# EAGLE design VectrexCard4 (EAGLE 9.6.2)
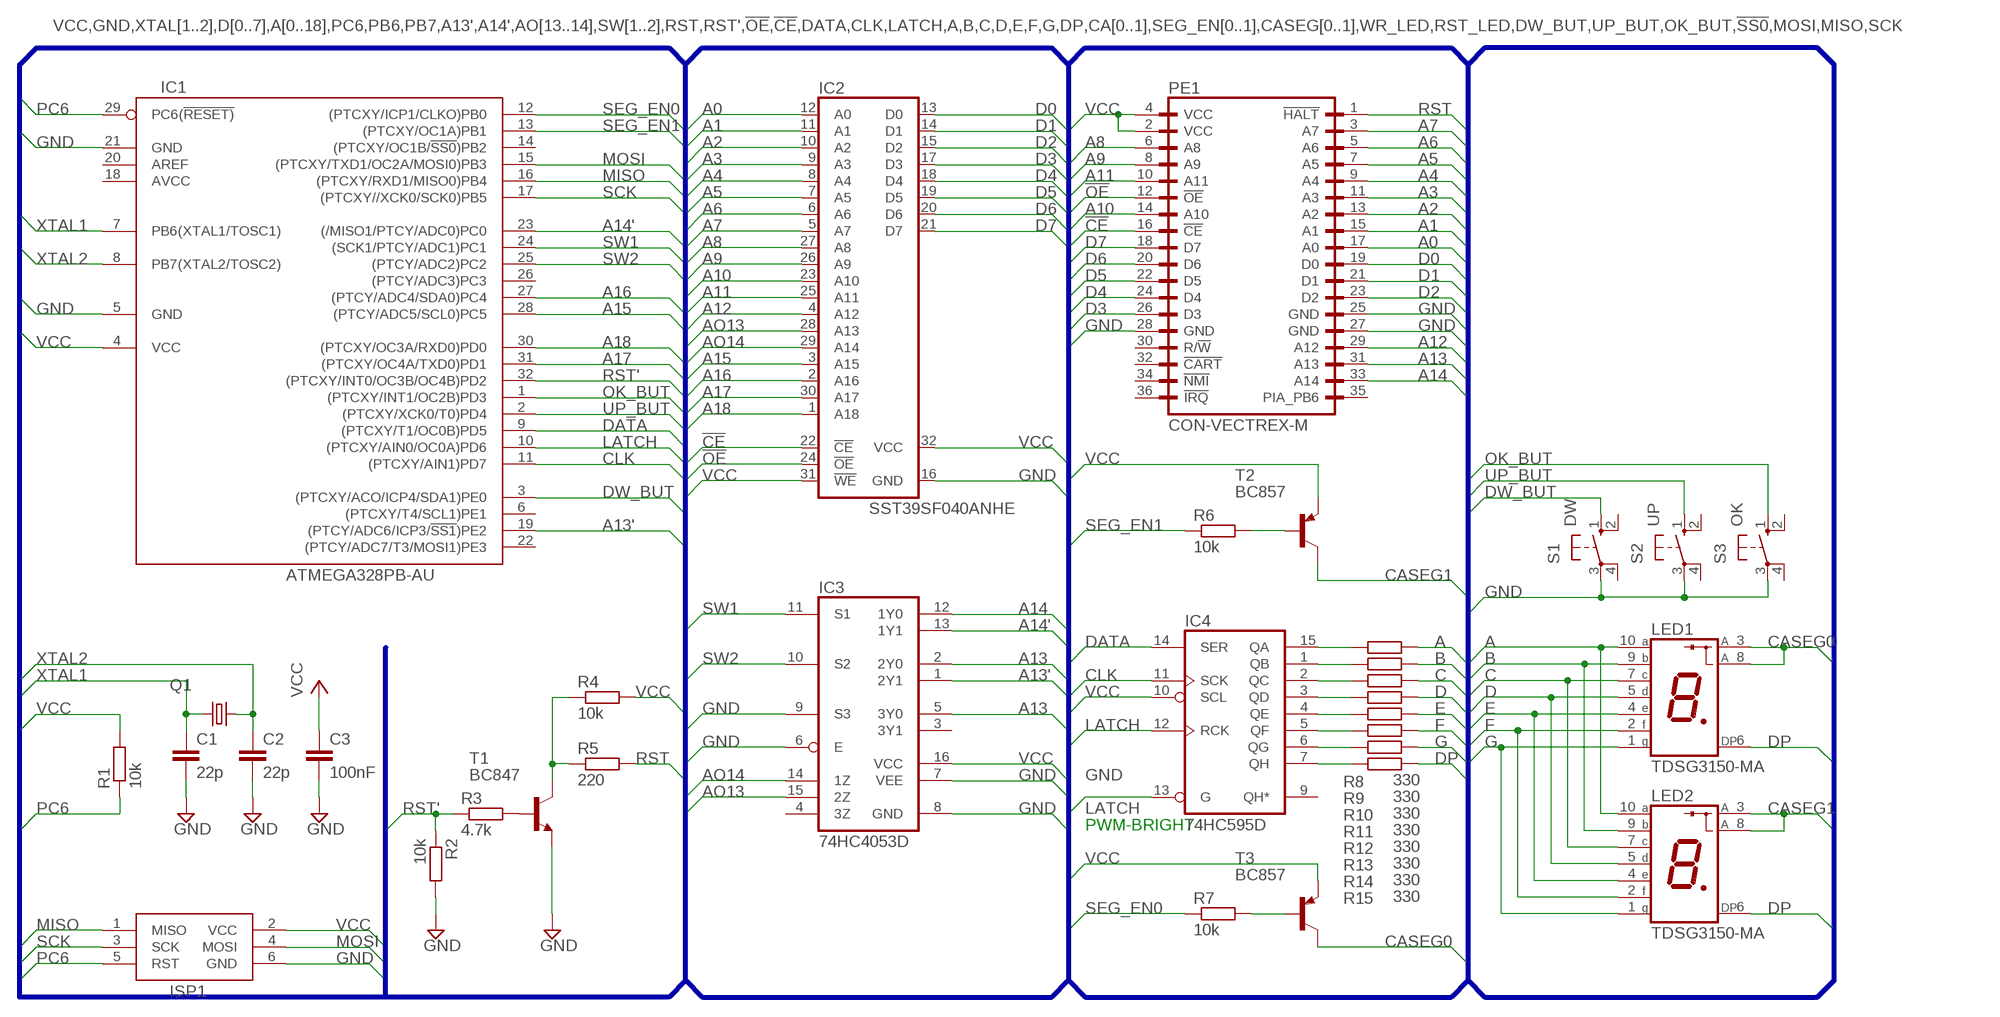
[diagram p0: schematic, sheet 1]

## Parts
C1  22p  C-EUC2012  [C2012]
C2  22p  C-EUC2012  [C2012]
C3  100nF  C-EU050-025X075  [C050-025X075]
IC1  ATMEGA328PB-AU  [TQFP32-08]
IC2  SST39SF040ANHE  [S32]
IC3  74HC4053D  744053D  [SO16]
IC4  74HC595D  [SO16]
ISP1  AVRISP-6  [AVRISP]
LED1  TDSG3150-MA  [LA-401]
LED2  TDSG3150-MA  [LA-401]
PE1  CON-VECTREX-M  [PCB_VECTREX_CONNECTOR]
Q1  8MHz  CRYSTALHC49U-V  [HC49U-V]
R1  10k  R-EU_0204/7  [0204/7]
R2  10k  R-EU_M2012  [M2012]
R3  4.7k  R-EU_M2012  [M2012]
R4  10k  R-EU_R2012  [R2012]
R5  220  R-EU_R2012  [R2012]
R6  10k  R-EU_M2012  [M2012]
R7  10k  R-EU_M2012  [M2012]
R8  330  R-EU_M2012  [M2012]
R9  330  R-EU_M2012  [M2012]
R10  330  R-EU_M2012  [M2012]
R11  330  R-EU_M2012  [M2012]
R12  330  R-EU_M2012  [M2012]
R13  330  R-EU_M2012  [M2012]
R14  330  R-EU_M2012  [M2012]
R15  330  R-EU_M2012  [M2012]
S1  DW  10-XX  [B3F-10XX]
S2  UP  10-XX  [B3F-10XX]
S3  OK  10-XX  [B3F-10XX]
T1  BC847  [SOT23]
T2  BC857  BC857A-PNP-SOT23-BEC  [SOT23-BEC]
T3  BC857  BC857A-PNP-SOT23-BEC  [SOT23-BEC]

## Nets
!CE: IC2.22(!CE) PE1.16(!CE)
!OE: IC2.24(!OE) PE1.12(!OE)
A: LED1.10(A) LED2.10(A) R8.2
A0: IC2.12(A0) PE1.17(A0)
A1: IC2.11(A1) PE1.15(A1)
A2: IC2.10(A2) PE1.13(A2)
A3: IC2.9(A3) PE1.11(A3)
A4: IC2.8(A4) PE1.9(A4)
A5: IC2.7(A5) PE1.7(A5)
A6: IC2.6(A6) PE1.5(A6)
A7: IC2.5(A7) PE1.3(A7)
A8: IC2.27(A8) PE1.6(A8)
A9: IC2.26(A9) PE1.8(A9)
A10: IC2.23(A10) PE1.14(A10)
A11: IC2.25(A11) PE1.10(A11)
A12: IC2.4(A12) PE1.29(A12)
A13: IC3.2(2Y0) IC3.5(3Y0) PE1.31(A13)
A13': IC1.19((PTCY/ADC6/ICP3/!SS1!)PE2) IC3.1(2Y1)
A14: IC3.12(1Y0) PE1.33(A14)
A14': IC1.23((/MISO1/PTCY/ADC0)PC0) IC3.13(1Y1)
A15: IC1.28((PTCY/ADC5/SCL0)PC5) IC2.3(A15)
A16: IC1.27((PTCY/ADC4/SDA0)PC4) IC2.2(A16)
A17: IC1.31((PTCXY/OC4A/TXD0)PD1) IC2.30(A17)
A18: IC1.30((PTCXY/OC3A/RXD0)PD0) IC2.1(A18)
AO13: IC2.28(A13) IC3.15(2Z)
AO14: IC2.29(A14) IC3.14(1Z)
B: LED1.9(B) LED2.9(B) R9.2
C: LED1.7(C) LED2.7(C) R10.2
CASEG0: LED1.3(A) LED1.8(A) T3.C
CASEG1: LED2.3(A) LED2.8(A) T2.C
CLK: IC1.11((PTCXY/AIN1)PD7) IC4.11(SCK)
D: LED1.5(D) LED2.5(D) R11.2
D0: IC2.13(D0) PE1.19(D0)
D1: IC2.14(D1) PE1.21(D1)
D2: IC2.15(D2) PE1.23(D2)
D3: IC2.17(D3) PE1.26(D3)
D4: IC2.18(D4) PE1.24(D4)
D5: IC2.19(D5) PE1.22(D5)
D6: IC2.20(D6) PE1.20(D6)
D7: IC2.21(D7) PE1.18(D7)
DATA: IC1.9((PTCXY/T1/OC0B)PD5) IC4.14(SER)
DP: LED1.6(DP) LED2.6(DP) R15.2
DW_BUT: IC1.3((PTCXY/ACO/ICP4/SDA1)PE0) S1.1(S)
E: LED1.4(E) LED2.4(E) R12.2
F: LED1.2(F) LED2.2(F) R13.2
G: LED1.1(G) LED2.1(G) R14.2
GND: C1.2 C2.2 C3.2 IC1.5(GND) IC1.21(GND) IC2.16(GND) IC3.6(E) IC3.7(VEE) IC3.8(GND) IC3.9(S3) IC4.13(G) ISP1.6(GND) PE1.25(GND) PE1.27(GND) PE1.28(GND) R2.2 S1.3(P) S2.3(P) S3.3(P) T1.2(E)
LATCH: IC1.10((PTCXY/AIN0/OC0A)PD6) IC4.12(RCK)
MISO: IC1.16((PTCXY/RXD1/MISO0)PB4) ISP1.1(MISO)
MOSI: IC1.15((PTCXY/TXD1/OC2A/MOSI0)PB3) ISP1.4(MOSI)
N$1: IC4.7(QH) R15.1
N$2: IC4.15(QA) R8.1
N$3: IC4.1(QB) R9.1
N$4: IC4.2(QC) R10.1
N$5: IC4.3(QD) R11.1
N$6: IC4.4(QE) R12.1
N$7: IC4.5(QF) R13.1
N$8: IC4.6(QG) R14.1
N$9: R3.2 T1.1(B)
N$11: R6.2 T2.B
N$12: R7.2 T3.B
N$15: R4.1 R5.1 T1.3(C)
OK_BUT: IC1.1((PTCXY/INT1/OC2B)PD3) S3.1(S)
PC6: IC1.29(PC6(!RESET)) ISP1.5(RST) R1.1
RST: PE1.1(!HALT) R5.2
RST': IC1.32((PTCXY/INT0/OC3B/OC4B)PD2) R2.1 R3.1
SCK: IC1.17((PTCXY//XCK0/SCK0)PB5) ISP1.3(SCK)
SEG_EN0: IC1.12((PTCXY/ICP1/CLKO)PB0) R7.1
SEG_EN1: IC1.13((PTCXY/OC1A)PB1) R6.1
SW1: IC1.24((SCK1/PTCY/ADC1)PC1) IC3.11(S1)
SW2: IC1.25((PTCY/ADC2)PC2) IC3.10(S2)
UP_BUT: IC1.2((PTCXY/XCK0/T0)PD4) S2.1(S)
VCC: C3.1 IC1.4(VCC) IC2.31(!WE) IC2.32(VCC) IC3.16(VCC) IC4.10(SCL) ISP1.2(VCC) PE1.2(VCC) PE1.4(VCC) R1.2 R4.2 T2.E T3.E
XTAL1: C1.1 IC1.7(PB6(XTAL1/TOSC1)) Q1.2
XTAL2: C2.1 IC1.8(PB7(XTAL2/TOSC2)) Q1.1
Unconnected: IC1.6((PTCXY/T4/SCL1)PE1) IC1.14((PTCXY/OC1B/!SS0!)PB2) IC1.18(AVCC) IC1.20(AREF) IC1.22((PTCY/ADC7/T3/MOSI1)PE3) IC1.26((PTCY/ADC3)PC3) IC3.3(3Y1) IC3.4(3Z) IC4.9(QH*) PE1.30(R/!W) PE1.32(!CART) PE1.34(!NMI) PE1.35(PIA_PB6) PE1.36(!IRQ) S1.2(S1) S1.4(P1) S2.2(S1) S2.4(P1) S3.2(S1) S3.4(P1)

## Buses
VCC,GND,XTAL[1..2],D[0..7],A[0..18],PC6,PB6,PB7,A13',A14',AO[13..14],SW[1..2],RST,RST',!OE,!CE,DATA,CLK,LATCH,A,B,C,D,E,F,G,DP,CA[0..1],SEG_EN[0..1],CASEG[0..1],WR_LED,RST_LED,DW_BUT,UP_BUT,OK_BUT,!SS0,MOSI,MISO,SCK

## Notes on the sheet
- PWM-BRIGHT

## Power pins joined to a net without a drawn wire
GND: IC4.8(GND)
VCC: IC4.16(VCC)

## Library data of the parts
C1-C3 = Custom:C-EU: CAPACITOR, European symbol
IC1 = Custom:ATMEGA328PB
IC2 = Custom:SST39SF040A: 4 Mbit x8 Multi-Purpose Flash Source: http://www.sst.com/dotAsset/40782.pdf
IC3 = Custom:74*4053: Triple 2-channel analog multiplexer/demultiplexer Philips Semiconductor
IC4 = 74xx-eu:74*595: 8-bit SHIFT REGISTER, output latch
ISP1 = Custom:AVRISP: AVR ISP HEADER Standard 6 pin header for AVR programming
LED1 LED2 = Custom:TDSG3150-M: Single Digit LED Numeric Display (anode common) Source: ROHM .. la-1401dn.pdf; OC_FARNELL: unknown; OC_NEWARK: unknown
PE1 = Custom:CON-VECTREX-M
Q1 = Custom:CRYSTAL: CRYSTAL; OC_FARNELL: 1666969; OC_NEWARK: unknown
R1-R15 = Custom:R-EU_: RESISTOR, European symbol
S1-S3 = Custom:10-XX: OMRON SWITCH; MPN: B3F-1000; OC_FARNELL: 176432; OC_NEWARK: 36M3542
T1 = transistor:BC847: NPN TRANSISTOR
T2 T3 = transistor:*-PNP-: PNP Transistror

## Board
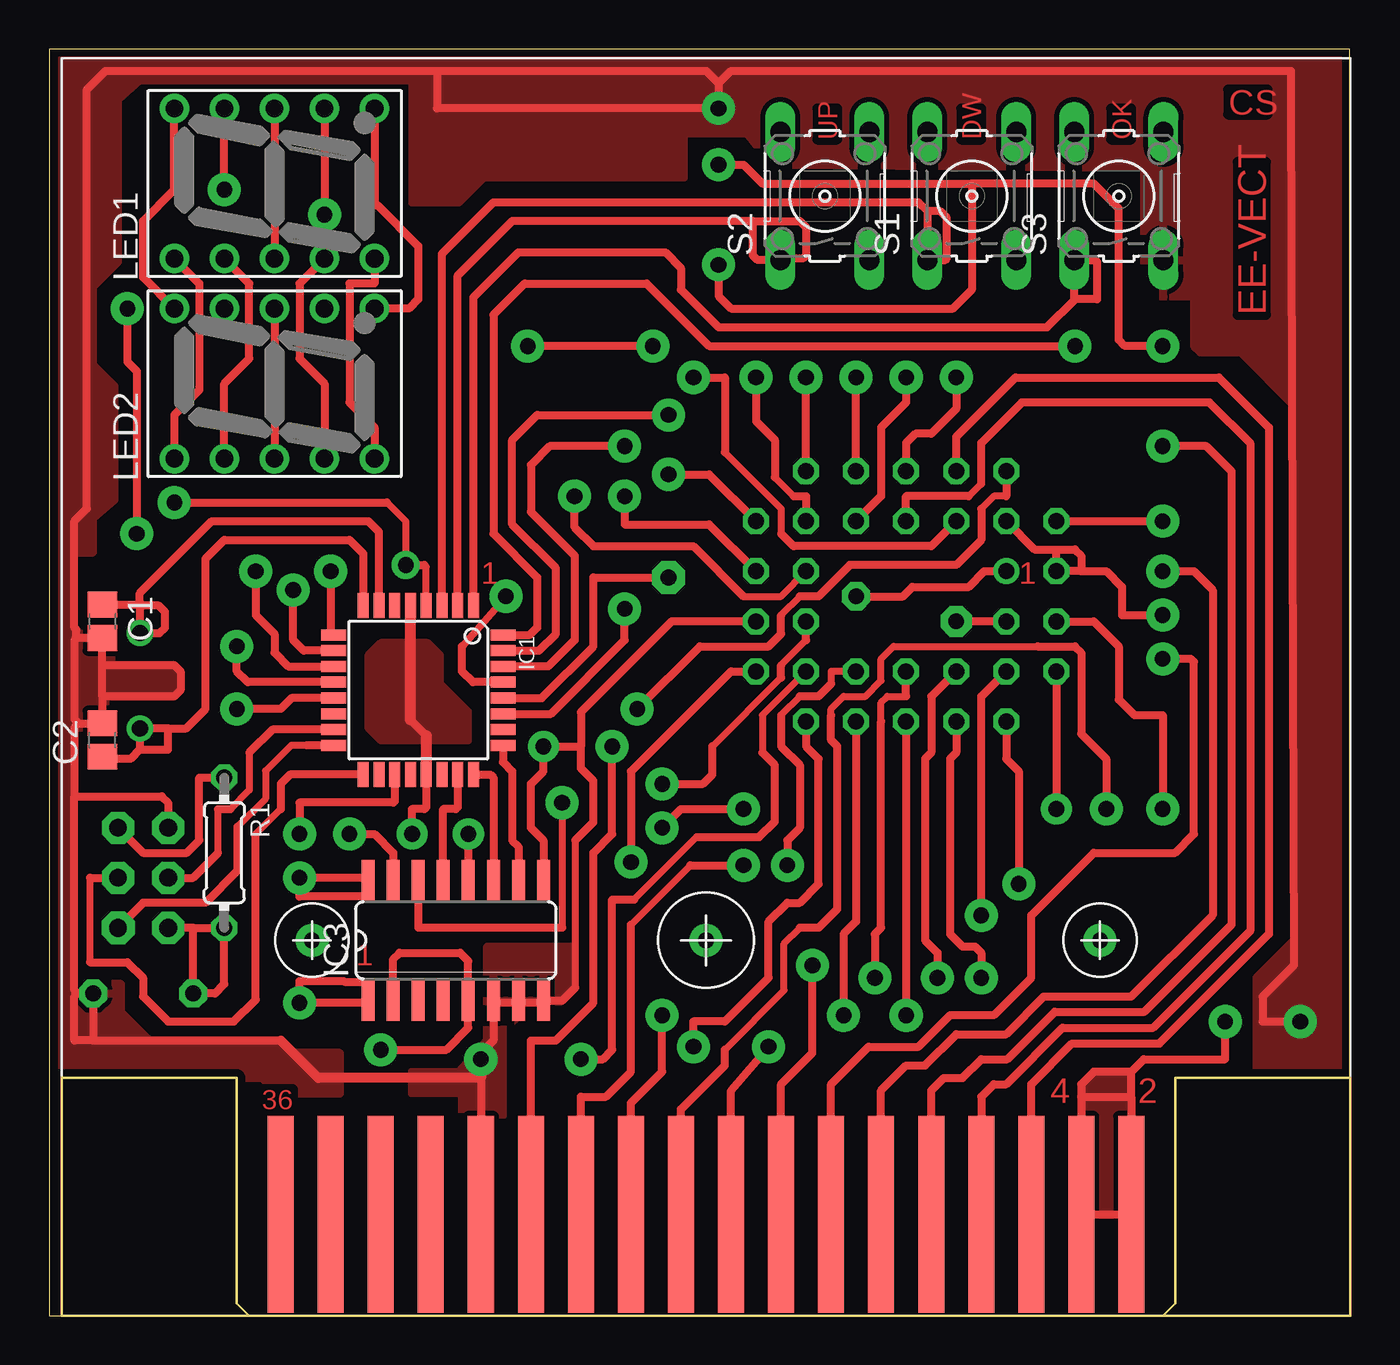
[diagram p1: board, top side]
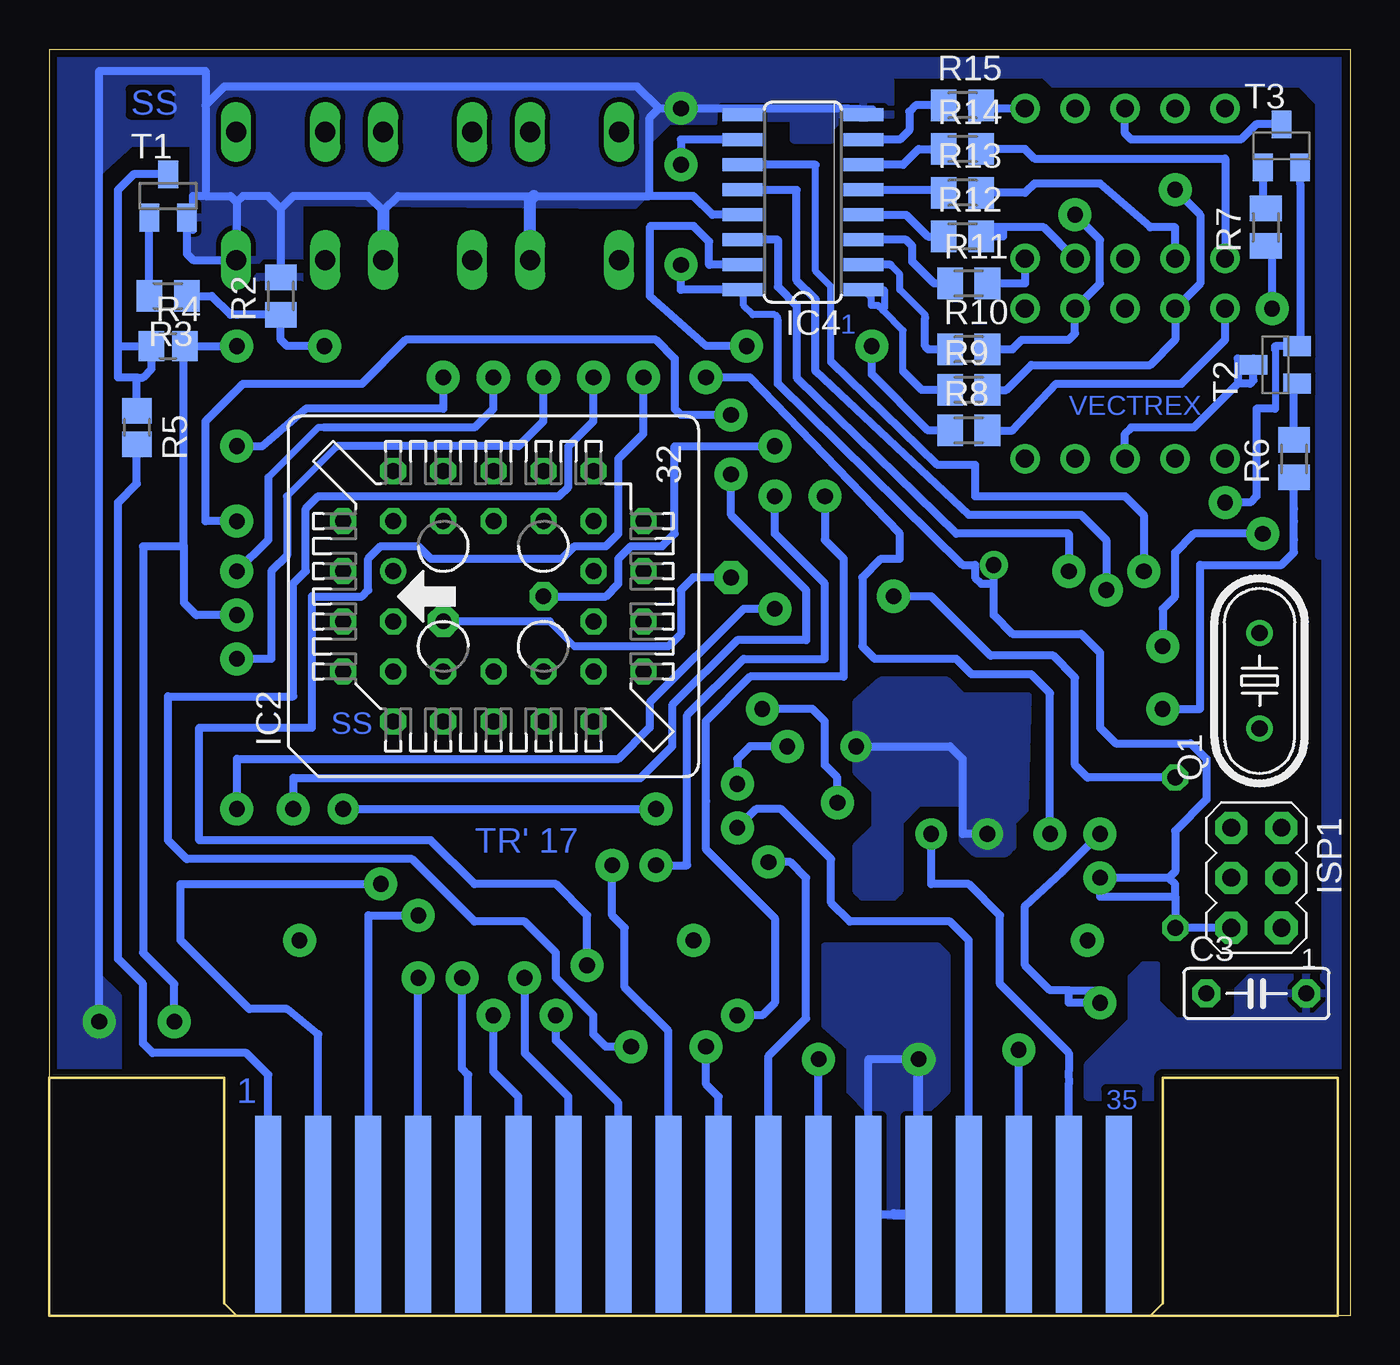
[diagram p2: board, bottom side, seen from below]

Size 66.04 x 64.28 mm. Coordinates in mm from the lower left corner, seen from the top.
Outline: 0.63,0 0,0 0,64.28 66.02,64.28 66.02,0 56.52,0
Outline: 10.16,0 9.52,0.64 9.52,12.06 0.63,12.06 0.63,0
Outline: 10.16,0 0.63,0
Outline: 56.52,0 66.04,0 66.04,12.06 57.15,12.06 57.15,0.64 56.52,0
Outline: 56.52,0 10.16,0
Copper layers (1*2*16): Top 0.035mm / dielectric 1.5mm / Route2 0.035mm / dielectric 0.15mm / Bottom 0.035mm
Design rules "default *": minimum track width 16mil, minimum drill 31mil, track to track 10mil, track to pad 20mil, pad to pad 8mil, via to via 8mil, smd to smd 8mil, copper to edge 15mil, drill to drill 8mil, minimum pad ring 10mil, minimum via ring 8mil, stop-mask expansion 4mil, vias tented up to drill 0mil, thermal gap 10mil

### Footprints (pad centres in the part's own frame; a part is rotated, then mirrored left to right if it is on the bottom)
C2012 = smd 1.3 x 1.5: 1 -0.85,0; 2 0.85,0
C050-025X075 = drill 0.813 pad 1.422 octagon: 1 -2.54,0; 2 2.54,0
TQFP32-08 = smd 1.27 x 0.559: 1 -4.293,2.8; 2 -4.293,2; 3 -4.293,1.2; 4 -4.293,0.4; 5 -4.293,-0.4; 6 -4.293,-1.2; 7 -4.293,-2; 8 -4.293,-2.8; 17 4.293,-2.8; 18 4.293,-2; 19 4.293,-1.2; 20 4.293,-0.4; 21 4.293,0.4; 22 4.293,1.2; 23 4.293,2; 24 4.293,2.8 | smd 0.559 x 1.27: 9 -2.8,-4.293; 10 -2,-4.293; 11 -1.2,-4.293; 12 -0.4,-4.293; 13 0.4,-4.293; 14 1.2,-4.293; 15 2,-4.293; 16 2.8,-4.293; 25 2.8,4.293; 26 2,4.293; 27 1.2,4.293; 28 0.4,4.293; 29 -0.4,4.293; 30 -1.2,4.293; 31 -2,4.293; 32 -2.8,4.293
S32 = drill 0.813: 1 1.27,5.08 | drill 0.813 octagon: 2 -1.27,7.62; 3 -1.27,5.08; 4 -3.81,7.62; 5 -6.35,5.08; 6 -3.81,5.08; 7 -6.35,2.54; 8 -3.81,2.54; 9 -6.35,0; 10 -3.81,0; 11 -6.35,-2.54; 12 -3.81,-2.54; 13 -6.35,-5.08; 14 -3.81,-7.62; 15 -3.81,-5.08; 16 -1.27,-7.62; 17 -1.27,-5.08; 18 1.27,-7.62; 19 1.27,-5.08; 20 3.81,-7.62; 21 6.35,-5.08; 22 3.81,-5.08; 23 6.35,-2.54; 24 3.81,-2.54; 25 6.35,0; 26 3.81,0; 27 6.35,2.54; 28 3.81,2.54; 29 6.35,5.08; 30 3.81,7.62; 31 3.81,5.08; 32 1.27,7.62
SO16 = smd 0.66 x 2.032: 1 -4.445,-3.073; 2 -3.175,-3.073; 3 -1.905,-3.073; 4 -0.635,-3.073; 5 0.635,-3.073; 6 1.905,-3.073; 7 3.175,-3.073; 8 4.445,-3.073; 9 4.445,3.073; 10 3.175,3.073; 11 1.905,3.073; 12 0.635,3.073; 13 -0.635,3.073; 14 -1.905,3.073; 15 -3.175,3.073; 16 -4.445,3.073
AVRISP = drill 0.9 pad 1.676 octagon: 1 -1.27,2.54 | drill 0.9 pad 1.626 octagon: 2 1.27,2.54; 3 -1.27,0; 4 1.27,0; 5 -1.27,-2.54; 6 1.27,-2.54
LA-401 = drill 0.9 pad 1.5: 1 -3.81,5.08; 2 -3.81,2.54; 3 -3.81,0; 4 -3.81,-2.54; 5 -3.81,-5.08; 6 3.81,-5.08; 7 3.81,-2.54; 8 3.81,0; 9 3.81,2.54; 10 3.81,5.08
PCB_VECTREX_CONNECTOR = smd 1.32 x 9.982 bottom: 1 21.59,3.873; 3 19.05,3.873; 5 16.51,3.873; 7 13.97,3.873; 9 11.43,3.873; 11 8.89,3.873; 13 6.35,3.873; 15 3.81,3.873; 17 1.27,3.873; 19 -1.27,3.873; 21 -3.81,3.873; 23 -6.35,3.873; 25 -8.89,3.873; 27 -11.43,3.873; 29 -13.97,3.873; 31 -16.51,3.873; 33 -19.05,3.873; 35 -21.59,3.873 | smd 1.32 x 9.982: 2 21.59,3.873; 4 19.05,3.873; 6 16.51,3.873; 8 13.97,3.873; 10 11.43,3.873; 12 8.89,3.873; 14 6.35,3.873; 16 3.81,3.873; 18 1.27,3.873; 20 -1.27,3.873; 22 -3.81,3.873; 24 -6.35,3.873; 26 -8.89,3.873; 28 -11.43,3.873; 30 -13.97,3.873; 32 -16.51,3.873; 34 -19.05,3.873; 36 -21.59,3.873
HC49U-V = drill 0.813: 1 -2.413,0; 2 2.413,0
0204/7 = drill 0.813 octagon: 1 -3.81,0; 2 3.81,0
M2012 = smd 1.3 x 1.6: 1 -0.95,0; 2 0.95,0
R2012 = smd 1.3 x 1.5: 1 -0.85,0; 2 0.85,0
B3F-10XX = drill 1.016 long: 1 -3.251,2.261; 2 3.251,2.261; 3 -3.251,-2.261; 4 3.251,-2.261
SOT23 = smd 1 x 1.4: 1 -0.95,-1.1; 2 0.95,-1.1; 3 0,1.1
SOT23-BEC = smd 1 x 1.4: B -0.95,-1.1; C 0,1.1; E 0.95,-1.1

### Placement (x,y rotation side)
C1  2.7,35.24 270 top
C2  2.7,29.21 90 top
C3  4.76,16.35 0 bottom
IC1  18.73,31.75 270 top
IC2  43.5,36.51 90 bottom
IC3  20.64,19.05 0 top
IC4  27.78,56.52 90 bottom
ISP1  4.76,22.23 180 bottom
LED1  11.43,57.47 90 top
LED2  11.43,47.31 90 top
PE1  33.34,1.27 0 top
Q1  4.6,32.23 90 bottom
R1  8.89,23.49 270 top
R2  54.29,51.75 90 bottom
R3  60.01,51.75 180 bottom
R4  60.01,49.21 0 bottom
R5  61.59,45.09 270 bottom
R6  2.86,43.5 90 bottom
R7  4.29,55.24 90 bottom
R8  19.37,44.93 0 bottom
R9  19.37,46.99 0 bottom
R10  19.37,49.05 0 bottom
R11  19.37,52.39 0 bottom
R12  19.68,54.77 0 bottom
R13  19.68,56.99 0 bottom
R14  19.68,59.21 0 bottom
R15  19.68,61.44 0 bottom
S1  46.83,56.83 90 top
S2  39.37,56.83 90 top
S3  54.29,56.83 90 top
T1  60.01,56.83 0 bottom
T2  3.81,48.26 90 bottom
T3  3.49,59.37 0 bottom

### Tracks (layer width: path | path; a pad name or v marks a point on that pad's centre or on a via)
!CE  (via drill 0.8 pad 1.68)
  Top 0.356: 36.83,42.55 37.78,41.59
  Top 0.406: 37.15,7.62 PE1.16 37.15,11.75 38.73,13.33 v38.73,17.78 | IC2.22 38.42,41.59 37.78,41.59 | v35.88,47.62 35.88,45.4 36.83,44.45 36.83,42.55
  Bottom 0.406: v35.88,47.62 35.88,44.77 37.15,43.5 37.15,39.69 37.78,39.05 39.37,39.05 40.01,38.42 46.67,38.42 47.31,39.05 49.21,39.05 49.85,38.42 49.85,36.83 50.16,36.51 52.7,36.51 52.7,29.84 58.42,29.84 58.42,24.13 46.67,24.13 44.45,21.91 40.32,21.91 38.73,20.32 v38.73,17.78
!OE  (via drill 0.8 pad 1.68)
  Top 0.406: IC2.24 42.23,41.59 42.23,45.09 43.5,46.35 v43.5,47.62 | PE1.12 42.23,11.43 43.5,12.7 44.45,12.7 46.04,14.29 48.58,14.29 50.48,16.19 54.93,16.19 59.06,20.32 59.06,36.83 58.1,37.78 v56.52,37.78
  Bottom 0.356: 52.07,45.09 52.39,45.09 54.93,42.55
  Bottom 0.406: 52.07,45.09 44.45,45.09 43.5,46.04 v43.5,47.62 | 54.93,42.55 54.93,39.37 v56.52,37.78
A
  Top 0.406: LED1.10 6.35,57.15 4.76,55.56 4.76,52.7 LED2.10
  Bottom 0.406: R8.2 17.14,44.93 14.92,47.31 8.57,47.31 6.35,49.53 LED2.10
A0  (via drill 0.8 pad 1.68)
  Top 0.356: 38.1,31.43 37.15,30.48 | 39.69,32.07 39.69,32.7 IC2.12
  Top 0.406: 37.15,30.48 37.15,28.89 38.1,27.94 38.1,24.77 37.47,24.13 v37.47,22.86 | 39.69,32.07 39.05,31.43 38.1,31.43
  Bottom 0.406: v37.47,22.86 37.47,20.32 36.83,19.69 36.83,16.67 34.61,14.45 PE1.17
A1  (via drill 0.8 pad 1.68)
  Top 0.406: v40.32,15.24 40.32,19.37 40.96,20 IC2.11
  Bottom 0.406: v40.32,15.24 40.32,13.97 37.15,10.79 PE1.15
A2  (via drill 0.8 pad 1.68)
  Top 0.356: 42.23,30.16 42.23,31.12 42.55,31.43 43.5,31.43
  Top 0.406: 43.5,31.43 IC2.10 | 42.23,30.16 42.23,19.69 41.91,19.37 v41.91,17.15
  Bottom 0.406: PE1.13 39.69,11.11 41.91,13.33 v41.91,17.15
A3  (via drill 0.8 pad 1.68)
  Top 0.406: IC2.9 v43.5,15.24
  Bottom 0.406: PE1.11 42.23,11.11 43.5,12.38 v43.5,15.24
A4  (via drill 0.8 pad 1.68)
  Top 0.406: v45.09,17.15 45.09,18.41 44.45,19.05 44.45,28.26 44.77,28.57 44.77,31.43 IC2.8
  Bottom 0.406: PE1.9 44.77,12.22 45.09,12.54 v45.09,17.15
A5  (via drill 0.8 pad 1.68)
  Top 0.406: IC2.7 46.04,28.57 45.72,28.26 45.72,19.37 46.35,18.73 46.99,18.73 47.31,18.41 v47.31,17.15
  Bottom 0.406: PE1.7 v47.31,17.15
A6  (via drill 0.8 pad 1.68)
  Top 0.406: IC2.6 47.31,31.43 v47.31,20.32
  Bottom 0.406: v47.31,20.32 49.85,20.32 PE1.5
A7  (via drill 0.8 pad 1.68)
  Top 0.406: IC2.5 48.58,28.26 49.21,27.62 v49.21,21.91
  Bottom 0.406: v49.21,21.91 59.37,21.91 59.37,19.05 55.88,15.56 53.98,15.56 52.39,14.29 PE1.3 52.39,9.05
A8
  Top 0.406: IC2.27 46.04,44.61 49.05,47.62 59.37,47.62 61.91,45.09 61.91,19.37 56.36,13.81 51.91,13.81 49.85,11.75 PE1.6
A9
  Top 0.356: 47.31,42.23 46.67,41.59
  Top 0.406: PE1.8 47.31,11.11 47.94,11.75 48.58,11.75 51.44,14.6 56.04,14.6 60.96,19.53 60.96,44.29 58.9,46.35 49.37,46.35 47.31,44.29 47.31,42.23 | IC2.26 43.5,41.59 46.67,41.59
A10  (via drill 0.8 pad 1.68)
  Top 0.406: IC2.23 v40.96,47.62 | v56.52,33.34 57.94,33.34 58.1,33.18 58.1,24.45 57.15,23.49 53.02,23.49 49.85,20.32 49.85,17.15 47.94,15.24 45.72,15.24 44.13,13.65 41.59,13.65 39.69,11.75 PE1.14
  Bottom 0.356: 51.44,44.13 53.98,41.59
  Bottom 0.406: v40.96,47.62 40.96,45.4 42.23,44.13 51.44,44.13 | 53.98,41.59 53.98,38.58 54.77,37.78 54.77,33.34 v56.52,33.34
A11  (via drill 0.8 pad 1.68)
  Top 0.406: v56.52,44.13 58.74,44.13 60.01,42.86 60.01,19.84 55.59,15.42 51.04,15.42 48.63,13.02 47.31,13.02 46.35,12.06 45.4,12.06 44.77,11.43 PE1.10 | IC2.25 43.5,44.29 43.97,44.77 44.77,44.77 46.04,46.04 v46.04,47.62
  Bottom 0.406: v46.04,47.62 46.04,46.04 53.02,46.04 55.24,44.13 v56.52,44.13
A12  (via drill 0.8 pad 1.57, 0.8 pad 1.68)
  Top 0.406: IC2.4 v51.12,25.72 | v35.24,25.72 32.07,25.72 v31.12,24.77
  Bottom 0.406: PE1.29 19.37,19.05 20.32,20 25.4,20 26.35,20.95 26.35,23.18 28.89,25.72 30.16,25.72 v31.12,24.77 | v51.12,25.72 v35.24,25.72
A13  (via drill 0.8 pad 1.68)
  Top 0.406: IC3.2 17.46,18.1 17.78,18.41 20.86,18.41 21.27,18 IC3.5 21.27,14.6 20.16,13.49 v16.83,13.49
  Bottom 0.406: PE1.31 v16.83,13.49
A13'  (via drill 0.8 pad 1.68)
  Top 0.406: IC3.1 16.09,15.88 v12.7,15.88 12.7,16.99 14.94,16.99 14.99,16.94 16.19,16.94 | v12.7,24.45 12.7,26.03 17.46,26.03 17.53,26.1 IC1.19
  Bottom 0.406: 14.29,16.51 14.29,15.88 v12.7,15.88 12.7,16.51 14.29,16.51 | 14.29,16.51 15.24,16.51 16.51,17.78 16.51,20.8 14.61,22.54 v12.7,24.45
A14  (via drill 0.8 pad 1.57)
  Top 0.406: v21.27,24.45 IC3.12
  Bottom 0.406: PE1.33 14.29,11.75 14.3,12.37 14.29,12.38 14.29,13.33 17.78,16.83 17.78,20.32 19.37,21.91 21.27,21.91 v21.27,24.45
A14'
  Top 0.406: IC3.13 20,25.72 20.64,25.72 20.73,25.81 IC1.23
A15  (via drill 0.8 pad 1.57, 0.8 pad 1.68)
  Top 0.406: IC2.3 v46.04,35.24 | IC1.28 25,31.35 27.62,33.97 27.62,37.46 v31.43,37.46
  Bottom 0.356: 39.37,33.97 40.64,35.24
  Bottom 0.406: 40.64,35.24 v46.04,35.24 | 39.37,33.97 34.61,33.97 33.97,34.61 33.97,36.83 33.34,37.46 v31.43,37.46
A16  (via drill 0.8 pad 1.68)
  Top 0.406: IC2.2 53.02,35.24 54.29,33.97 54.29,31.27 55.09,30.48 56.52,30.48 v56.52,25.72 | IC1.27 25.47,30.55 29.21,34.29 v29.21,35.88
  Bottom 0.406: v56.52,25.72 56.52,28.26 37.15,28.26 35.56,29.84 35.56,31.12 30.8,35.88 v29.21,35.88
A17  (via drill 0.8 pad 1.68)
  Top 0.406: IC1.31 24.86,33.75 25.72,34.61 25.72,37.94 23.5,40.16 23.5,44.45 24.77,45.72 v31.43,45.72 | IC2.30 v56.52,40.32
  Bottom 0.406: v56.52,40.32 58.1,40.32 58.1,45.4 56.2,47.31 50.16,47.31 47.94,49.53 35.24,49.53 34.29,48.58 34.29,46.04 33.97,45.72 v31.43,45.72
A18  (via drill 0.8 pad 1.42, 0.8 pad 1.68)
  Top 0.406: IC1.30 25.33,32.95 26.67,34.29 26.67,38.58 24.45,40.8 24.45,43.18 25.4,44.13 v29.21,44.13 | IC2.1 47.47,37.78 46.67,36.99 43.81,36.99 43.34,36.51 v40.96,36.51
  Bottom 0.406: v40.96,36.51 37.78,36.51 37.15,37.15 37.15,38.42 36.51,39.05 34.92,39.05 34.29,39.69 34.29,44.13 v29.21,44.13
AO13  (via drill 0.8 pad 1.68)
  Top 0.356: 37.15,39.69 37.15,40.96 34.29,43.81
  Top 0.406: IC2.28 44.77,39.05 37.78,39.05 37.15,39.69 | IC3.15 17.46,23.49 16.51,24.45 v15.24,24.45 | v32.7,47.62 34.29,47.62 34.29,43.81
  Bottom 0.406: v15.24,24.45 15.24,31.59 16.19,32.54 19.21,32.54 20,33.34 24.13,33.34 24.77,33.97 24.77,37.46 23.81,38.42 22.86,38.42 22.86,39.69 30.48,47.62 v32.7,47.62
AO14  (via drill 0.8 pad 1.68)
  Top 0.356: v26.03,26.03 26.03,19.69 | 48.58,41.59 47.94,41.59 47.31,40.96 | 38.1,36.51 37.15,35.56
  Top 0.406: IC3.14 18.73,19.69 26.03,19.69 | IC2.29 48.58,41.59 | 47.31,40.96 47.31,39.37 46.04,38.1 40.64,38.1 39.05,36.51 38.1,36.51 | 37.15,35.56 37.15,34.61 36.51,33.97 33.02,33.97 v29.84,30.8
  Bottom 0.406: v29.84,30.8 27.3,30.8 26.67,30.16 26.67,27.94 26.03,27.3 v26.03,26.03
B  (via drill 0.8 pad 1.68)
  Top 0.406: v8.89,57.15 LED1.9
  Bottom 0.406: R9.2 17.46,46.99 16.19,48.26 10.16,48.26 8.89,49.53 LED2.9 7.62,52.39 7.62,55.88 v8.89,57.15
C  (via drill 0.8 pad 1.68)
  Top 0.406: LED1.7 v13.97,55.88
  Bottom 0.406: R10.2 17.14,49.05 16.67,49.53 14.29,49.53 13.97,49.85 LED2.7 12.7,52.39 12.7,54.61 v13.97,55.88
CASEG0
  Top 0.406: LED1.8 LED1.3
  Bottom 0.406: LED1.8 11.43,60.01 11.11,59.69 5.56,59.69 4.77,60.47 T3.C
CASEG1
  Top 0.406: LED2.8 LED2.3
  Bottom 0.406: 5.71,47.31 5.71,48.58 4.91,48.58 T2.C 4.91,47.48 5.08,47.31 5.71,47.31 | LED2.3 11.43,44.77 11.11,45.09 7.94,45.09 5.71,47.31
CLK  (via drill 0.8 pad 1.68)
  Top 0.406: IC1.11 12.14,32.95 11.43,33.66 11.43,34.61 10.48,35.56 v10.48,37.78
  Bottom 0.356: 26.35,48.42 26.35,52.23 27.15,53.02 27.15,58.42
  Bottom 0.406: v10.48,37.78 10.48,40.64 11.43,41.59 19.05,41.59 19.05,43.18 20.95,43.18 26.35,48.42 | 27.15,58.42 IC4.11
D
  Top 0.406: LED1.5 16.51,52.39 15.24,52.39 15.24,46.35 16.51,45.09 LED2.5
  Bottom 0.406: LED1.5 16.51,52.39 R11.2
D0  (via drill 0.8 pad 1.68)
  Top 0.406: IC2.13 38.42,28.89 39.05,28.26 39.05,21.91 38.1,20.95 37.47,20.95 36.51,20 36.51,17.15 34.29,14.92 32.7,14.92 v32.7,13.65
  Bottom 0.406: PE1.19 32.07,11.11 32.7,11.75 v32.7,13.65
D1  (via drill 0.8 pad 1.68)
  Top 0.406: v29.53,23.02 29.53,27.62 34.61,32.7 IC2.14
  Bottom 0.406: PE1.21 29.53,13.18 27.62,15.08 27.62,22.23 28.42,23.02 v29.53,23.02
D2  (via drill 0.8 pad 1.68)
  Top 0.356: IC2.15 36.2,30.48 36.2,28.57 | 29.69,21.11 32.86,24.29
  Top 0.406: 29.69,21.11 28.58,21.11 28.58,13.49 28.1,13.02 v26.99,13.02 | 36.2,28.57 36.83,27.94 36.83,25.08 36.04,24.29 32.86,24.29
  Bottom 0.406: PE1.23 v26.99,13.02
D3  (via drill 0.8 pad 1.68)
  Top 0.356: 37.15,33.02 38.42,34.29 | 37.15,32.38 33.66,28.89
  Top 0.406: PE1.26 24.45,13.97 25.72,13.97 27.62,15.88 27.62,23.49 28.58,24.45 v28.58,28.89 | 38.42,34.29 IC2.17 | 37.15,32.38 37.15,33.02 | v31.12,26.99 33.18,26.99 33.66,27.46 33.66,28.89
  Bottom 0.406: v28.58,28.89 30.48,28.89 31.12,28.26 v31.12,26.99
D4  (via drill 0.8 pad 1.68)
  Top 0.356: 29.53,19.84 32.54,22.86
  Top 0.406: 29.53,19.84 29.53,12.38 28.26,11.11 26.99,11.11 PE1.24 | IC2.18 33.5,40.16 29.21,40.16 v29.21,41.59 | 32.54,22.86 v35.24,22.86
  Bottom 0.406: v35.24,22.86 33.66,22.86 33.66,30.48 30.8,33.34 26.67,33.34 26.67,37.15 29.21,39.69 v29.21,41.59
D5  (via drill 0.8 pad 1.68)
  Top 0.356: IC2.19 37.15,36.51 35.24,36.51
  Top 0.406: PE1.22 29.53,10.79 31.12,12.38 v31.12,15.24 | v26.67,41.59 26.67,40 27.62,39.05 32.7,39.05 35.24,36.51
  Bottom 0.406: v26.67,41.59 26.67,39.37 25.72,38.42 25.72,32.43 30.46,32.43 32.73,30.16 32.73,26.13 32.7,26.11 32.7,23.65 29.21,20.16 29.21,15.88 29.84,15.24 v31.12,15.24
D6  (via drill 0.8 pad 1.68)
  Top 0.356: 34.29,13.49 37.31,16.51 37.31,18.89 38.1,19.69 | 39.69,30.48 39.69,30.8 40.32,31.43 41.43,31.43 42.23,32.23 42.23,33.34 42.86,33.97 50.16,33.97
  Top 0.406: PE1.20 32.07,10.48 34.29,12.7 34.29,13.49 | 38.1,19.69 39.05,19.69 40.01,20.64 40.01,28.89 39.69,29.21 39.69,30.48 | 50.16,33.97 52.07,33.97 52.39,33.66 52.39,29.53 53.66,28.26 v53.66,25.72 | v31.43,42.7 33.5,42.7 IC2.20
  Bottom 0.406: v53.66,25.72 53.66,27.3 53.63,27.28 36.03,27.28 34.42,28.89 34.42,30.99 31.12,34.29 27.62,34.29 27.62,36.83 31.43,40.64 v31.43,42.7
D7  (via drill 0.8 pad 1.68)
  Top 0.406: PE1.18 34.61,11.43 v36.51,13.65 | IC2.21 v38.42,47.62
  Bottom 0.406: v38.42,47.62 38.42,45.4 39.69,44.13 39.69,42.07 40.16,41.59 52.39,41.59 53.02,40.96 53.02,37.78 53.66,37.15 53.66,31.43 60.01,31.43 60.01,24.13 59.06,23.18 47.62,23.18 44.45,20 41.91,20 40.32,18.41 40.32,17.15 38.42,15.24 38.42,14.29 37.78,13.65 v36.51,13.65
DATA  (via drill 0.8 pad 1.68)
  Top 0.406: v14.29,37.78 14.29,34.7 IC1.9
  Bottom 0.406: v14.29,37.78 14.29,39.69 20,39.69 28.1,47.62 28.1,51.28 29.05,52.23 29.05,54.61 IC4.14
DP
  Top 0.406: LED1.6 16.51,56.36 16.67,56.36 18.73,54.29 18.73,51.59 18.26,51.12 LED2.6
  Bottom 0.406: R15.2 19.21,61.44 19.21,61.28 LED1.6
DW_BUT
  Top 0.406: 44.57,56.08 S1.1 45.49,53.58 45.56,53.66 45.56,55.72 45.21,56.08 44.57,56.08 | 44.57,56.08 44.13,56.52 22.54,56.52 19.93,53.91 IC1.3
E
  Top 0.406: LED1.4 12.7,52.39 12.7,48.58 13.97,47.31 LED2.4
  Bottom 0.406: LED1.4 15.56,55.24 18.26,55.24 R12.2 18.41,54.77 | 18.41,54.77 17.62,54.77 17.62,55.09 18.57,55.09 18.57,55.24 18.73,55.24 18.73,54.93 18.41,54.93 18.41,54.77
F
  Top 0.406: LED1.2 10.16,52.39 10.16,48.58 8.89,47.31 LED2.2
  Bottom 0.406: LED1.2 8.89,55.24 10.16,55.24 12.7,57.47 16.03,57.47 16.51,56.99 R13.2
G
  Top 0.406: LED1.1 7.62,52.39 7.62,46.99 6.35,45.72 LED2.1
  Bottom 0.406: LED1.1 6.35,58.74 16.03,58.74 16.51,59.21 R14.2
GND  (via drill 0.8 pad 1.57, 0.8 pad 1.68)
  Top 0.356: 26.7,24.13 26.7,16.64
  Top 0.406: 21.91,12.06 PE1.27 | 23.81,15.88 22.54,15.88 IC3.6 22.54,13.97 21.91,13.33 v21.91,13.02 | 23.81,15.88 IC3.7 | 23.81,15.88 24.77,15.88 IC3.8 26.03,15.98 26.7,16.64 | 1.43,16.35 C3.2 2.22,13.97 | 1.43,16.35 1.27,16.51 1.27,26.35 | 1.43,16.35 1.27,16.19 1.27,13.97 2.22,13.97 | 2.7,31.43 C2.2 1.48,30.06 | 2.7,31.43 2.7,33.02 | 2.7,33.02 C1.2 1.37,34.39 | 1.48,30.06 1.27,29.84 1.27,26.35 | 1.37,34.39 1.27,34.29 1.27,30.27 1.48,30.06 | 2.7,33.02 6.35,33.02 6.67,32.7 6.67,31.75 6.35,31.43 2.7,31.43 | 1.27,26.35 5.71,26.35 6.03,26.03 ISP1.6 | 19.13,29.45 18.33,30.24 | 1.37,34.39 1.37,34.82 1.27,34.92 1.27,40.32 1.9,40.96 1.9,62.23 2.86,63.18 19.68,63.18 | 19.68,63.18 19.68,61.28 v33.97,61.28 33.97,62.55 | 19.68,63.18 33.34,63.18 33.97,62.55 | 33.97,62.55 34.61,63.18 63.02,63.18 63.02,61.75 63.18,17.78 61.59,16.19 61.59,14.92 v63.5,14.92 | 2.22,13.97 11.75,13.97 | IC3.9 25.08,24.13 24.45,24.77 24.45,26.99 25.08,27.62 v25.08,28.89 26.99,28.89 | v18.41,24.45 18.41,25.72 19.05,25.72 19.13,25.8 IC1.21 | IC2.16 31.59,35.24 26.99,30.64 26.99,28.89 | 26.7,24.13 27.62,25.06 27.62,27.15 26.99,27.78 26.99,28.89
  Top 0.508: v21.91,13.02 21.91,12.06 13.65,12.06 11.75,13.97
  Top 0.559: 18.33,30.24 IC1.5 | 19.13,29.45 IC1.21
  Bottom 0.406: PE1.27 PE1.25 24.45,13.02 v21.91,13.02 | 35.56,56.83 35.56,60.8 35.08,61.28 | 35.08,61.28 v33.97,61.28 26.03,61.28 24.23,61.22 IC4.8 | 54.29,56.2 53.66,56.83 49.85,56.83 49.09,56.08 48.34,56.83 41.43,56.83 35.56,56.83 | 54.29,56.2 R2.2 | 54.29,56.2 54.93,56.83 56.2,56.83 56.52,56.52 | 56.52,56.52 56.52,53.62 S3.3 58.74,53.58 59.06,53.9 T1.2 | 58.1,56.83 58.74,56.83 58.74,55.1 | 58.1,56.83 56.83,56.83 56.52,56.52 | v18.41,24.45 19.68,24.45 19.68,28.26 20.32,28.89 v25.08,28.89 | v63.5,14.92 63.5,63.18 58.1,63.18 58.1,61.44 | 58.1,61.44 57.15,62.39 36.2,62.39 35.08,61.28 | IC4.13 32.38,55.88 33.34,56.83 35.56,56.83 | 58.1,61.44 58.1,56.83
  Bottom 0.508: 23.18,5.14 PE1.27 v21.91,13.02
  Bottom 0.61: 49.09,56.08 S1.3 | S2.3 41.63,56.64 41.43,56.83
  pour Top: 22.23,13.97 22.23,18.73 26.67,18.73 26.67,16.67 25.88,15.88 24.61,15.88 23.02,14.45 23.02,10.16 20.95,10.16 20.95,11.27 18.41,11.27 18.41,12.38 20.8,12.38
  pour Top: 61.28,12.06 66.04,12.06 66.04,63.82 0.63,63.82 0.63,12.06 10.8,12.06 11.59,11.27 14.76,11.27 14.76,13.33 12.38,13.33 11.75,13.97 5.08,13.97 3.65,15.4 3.65,16.83 1.27,16.83 1.27,29.84 2.86,29.84 2.86,31.43 6.35,31.43 6.67,31.75 6.67,32.7 6.35,33.02 3.18,33.02 3.18,34.61 1.27,34.61 1.27,38.73 2.22,38.73 2.22,40.48 3.33,41.43 3.33,47.15 2.22,48.26 2.22,52.23 3.49,53.5 3.49,61.75 4.6,62.71 18.41,62.71 18.41,56.52 20.8,56.52 22.07,57.79 32.23,57.79 32.23,60.01 35.4,60.01 36.67,58.42 55.56,58.26 55.56,51.75 58.1,51.75 58.1,49.21 58.42,48.89 60.48,48.89 63.18,46.2 63.18,19.05 61.28,17.15
  pour Bottom: 20.48,11.43 20.48,18.26 20.95,18.73 26.67,18.73 26.67,14.76 25.4,13.65 25.4,11.43 24.45,10.48 24.45,5.08 21.91,5.08 21.91,10
  pour Bottom: 66.04,12.06 62.55,12.06 62.55,16.19 63.66,17.3 63.66,57.94 61.91,59.53 58.74,59.53 58.74,53.66 57.47,53.66 57.47,52.39 53.34,52.39 53.34,56.52 36.35,56.36 35.56,57.15 35.56,59.69 34.61,60.64 32.23,60.64 32.23,60.8 28.26,60.8 28.26,59.69 26.35,59.69 26.35,60.32 25.88,60.8 23.34,60.8 23.34,63.02 15.56,63.02 15.08,62.55 2.54,62.55 1.59,61.59 1.59,38.58 1.27,38.58 1.27,17.15 5.08,17.15 5.71,16.51 5.71,15.24 6.03,14.92 8.89,14.92 9.84,15.88 9.84,17.78 10.48,17.78 11.11,17.15 11.11,14.92 13.34,12.7 13.34,11.11 9.52,11.11 9.52,12.06 0.63,12.06 0.63,63.82 66.04,63.82
  pour Top: 19.84,33.5 19.21,34.13 16.83,34.13 16.19,33.5 16.19,29.84 16.83,29.21 21.27,29.21 21.27,30.64 19.84,32.07
  pour Bottom: 16.35,31.43 19.68,31.43 20.48,32.23 23.81,32.23 25.08,31.12 25.08,27.62 24.13,26.67 24.13,24.77 25.08,23.81 25.08,21.59 24.77,21.27 23.18,21.27 22.86,21.59 22.86,25.08 21.91,26.03 19.68,26.03 19.68,24.13 19.05,23.49 17.46,23.49 17.14,23.81 17.14,25.08 16.51,25.72
LATCH  (via drill 0.8 pad 1.68)
  Top 0.406: IC1.10 12.92,33.75 12.38,34.29 v12.38,36.83
  Bottom 0.406: v12.38,36.83 12.38,39.37 13.65,40.64 19.37,40.64 27.15,47.94 27.15,51.59 28.1,52.55 28.1,57.15 IC4.12
MISO
  Top 0.356: 9.55,24.81 10.98,26.24 10.98,27.65 12.28,28.95 13.07,28.95
  Top 0.406: ISP1.1 4.76,20.95 7.94,20.95 9.55,22.57 9.55,24.81 | IC1.16 13.07,28.95
MOSI
  Top 0.356: 8.57,23.49 8.57,25.72 | 9.21,25.72 10.16,26.67 10.16,28.57
  Top 0.406: 8.57,23.49 7.3,22.23 ISP1.4 | 8.57,25.72 9.21,25.72 | 10.16,28.57 11.34,29.75 IC1.15
N$1
  Bottom 0.406: R15.1 22.07,61.44 22.38,61.12 22.38,60.17 22.86,59.69 IC4.7
N$2  (via drill 0.8 pad 1.68)
  Top 0.406: v30.64,49.21 v24.29,49.21
  Bottom 0.406: R8.1 21.43,44.93 24.29,47.78 v24.29,49.21 | 31.43,53.34 IC4.15 32.54,53.34 32.54,54.52 33.33,55.31 35.5,55.31 35.56,55.24 35.56,51.75 32.7,49.21 v30.64,49.21
N$3
  Bottom 0.356: 22.7,47.94 22.7,50.01 23.73,51.04 | 23.73,51.04 23.97,51.28 24.31,51.28 24.31,51.67 IC4.1 23.65,52.07 23.65,51.12 23.73,51.04
  Bottom 0.406: 22.7,47.94 21.75,46.99 R9.1
N$4
  Bottom 0.356: 21.59,50.64 21.59,50.8 22.86,52.07 22.86,52.86 23.34,53.34
  Bottom 0.406: R10.1 21.43,49.05 21.59,49.21 21.59,50.64 | 23.34,53.34 IC4.2
N$5
  Bottom 0.406: R11.1 21.11,52.39 22.23,53.5 22.23,54.29 22.54,54.61 IC4.3
N$6
  Bottom 0.406: IC4.4 22.54,55.88 21.43,54.77 R12.1
N$7
  Bottom 0.406: IC4.5 20.79,57.15 R13.1
N$8
  Bottom 0.406: IC4.6 22.7,58.42 21.91,59.21 R14.1 | R14.1 20.16,59.21 20.16,59.22 R14.1
N$9
  Bottom 0.406: R3.2 T1.1
N$11
  Bottom 0.406: R6.2 2.86,47.48 T2.B
N$12
  Bottom 0.406: T3.B 4.44,56.52 R7.2
N$15
  Bottom 0.406: T1.3 61.77,57.93 62.55,57.15 62.55,49.21 | 62.55,49.21 62.55,47.62 61.59,47.62 | 62.55,49.21 R4.1 60.86,48.05 61.28,47.62 61.59,47.62 | R5.1 61.59,47.62
N$16  (via drill 0.8 pad 1.68)
  other vias: 13.34,19.05
N$17  (via drill 0.8 pad 1.68)
  other vias: 33.34,19.05
N$18  (via drill 0.8 pad 1.68)
  other vias: 53.34,19.05
OK_BUT
  Top 0.406: 52.03,51.56 S3.1 53.1,53.58 53.18,53.5 53.18,51.59 52.07,51.59 52.03,51.56 | 52.03,51.56 50.64,50.16 33.97,50.16 32.07,52.07 32.07,53.18 31.27,53.98 23.81,53.98 21.53,51.7 IC1.1
PC6  (via drill 0.8 pad 1.68)
  Top 0.356: 20.95,33.97 v23.18,36.51
  Top 0.406: R1.1 7.62,27.3 7.62,24.13 6.98,23.49 4.76,23.49 ISP1.5 | IC1.29 21.51,32.15 20.95,32.7 20.95,33.97
  Bottom 0.406: R1.1 13.34,27.3 13.97,27.94 13.97,32.38 15.08,33.5 18.26,33.5 21.27,36.51 v23.18,36.51
RST
  Bottom 0.406: R5.2 61.59,42.23 62.55,41.27 62.55,18.1 61.28,16.83 61.28,13.81 60.8,13.33 56.04,13.33 54.93,12.22 PE1.1
RST'  (via drill 0.8 pad 1.68)
  Top 0.406: IC1.32 24.39,34.55 24.77,34.92 24.77,37.46 22.54,39.69 22.54,50.8 24.13,52.39 30.32,52.39 33.5,49.21 v52.07,49.21
  Bottom 0.406: R3.1 57.78,51.75 56.83,50.8 56.51,50.8 R2.1 54.29,49.53 53.98,49.21 v52.07,49.21
SCK
  Top 0.356: 2.06,22.23 2.06,17.94 | 10.48,24.45 11.75,25.72
  Top 0.406: 10.48,24.45 10.48,16.03 9.37,14.92 6.03,14.92 4.76,16.19 4.76,17.15 3.97,17.94 2.06,17.94 | 2.06,22.23 ISP1.3 | 11.75,25.72 11.75,26.99 12.22,27.46 IC1.17
SEG_EN0  (via drill 0.8 pad 1.68)
  Top 0.406: v3.97,51.12 3.97,48.42 4.45,47.94 v4.45,39.69 | IC1.12 10.08,32.15 9.52,32.7 v9.52,33.97
  Bottom 0.406: v4.45,39.69 7.94,39.69 8.89,38.73 8.89,36.51 9.52,35.88 v9.52,33.97 | v3.97,51.12 3.97,53.98 R7.1
SEG_EN1  (via drill 0.8 pad 1.68)
  Top 0.406: v9.52,30.8 11.75,30.8 12.3,31.35 IC1.13
  Bottom 0.406: v9.52,30.8 7.62,30.8 7.62,38.1 3.49,38.1 2.86,38.73 2.86,39.37 2.86,40.32 2.86,40.96 R6.1
SW1
  Top 0.406: IC1.24 22.39,27.46 22.54,27.3 IC3.11
SW2
  Top 0.406: IC1.25 23.03,28.09 23.5,27.62 23.5,24.13 23.81,23.81 IC3.10
UP_BUT
  Top 0.406: IC1.2 20.73,52.8 23.5,55.56 35.72,55.56 | 35.72,55.56 38.1,55.56 38.42,55.24 38.42,53.82 38.26,53.66 37.19,53.66 S2.1 35.95,53.58 35.72,53.82 35.72,55.56
VCC  (via drill 0.8 pad 1.42, 0.8 pad 1.68)
  Top 0.356: IC1.4 19.13,38.02 19.05,38.1 | 17.14,41.27 18.1,40.32 v18.1,38.1
  Top 0.406: 54.93,11.11 PE1.2 PE1.4 52.39,11.11 | 54.93,11.11 54.93,12.38 | 52.39,37.78 IC2.32 51.12,38.79 | 52.39,37.78 52.39,38.58 52.07,38.89 50.01,38.89 IC2.31 | v6.35,41.27 17.14,41.27 | v18.1,38.1 19.05,38.1 | 7.3,19.69 R1.2 8.89,16.83 8.41,16.35 C3.1 7.3,19.69 | 7.3,19.69 ISP1.2 | IC3.16 15.87,22.23 v12.7,22.23 12.7,21.27 16.19,21.27 IC3.16 | v59.69,14.92 59.69,13.02 55.56,13.02 54.93,12.38 | v56.52,49.21 54.61,49.21 54.29,49.53 54.29,56.2 53.02,57.47 46.83,57.47 | 46.83,57.47 36.2,57.47 35.24,58.42 v33.97,58.42 | 46.83,57.47 46.83,52.07 45.88,51.12 34.61,51.12 33.97,51.75 v33.97,53.34 | 52.39,37.78 53.66,37.78 54.45,36.99 54.45,35.56 v56.52,35.56 | 54.93,12.38 53.02,12.38 52.39,11.75 52.39,11.11 | 52.39,11.11 54.93,11.11 | IC3.16 16.19,22.23
  Bottom 0.356: 3.81,49.05 3.81,46.04 | 29.05,50.48 29.05,50.64 29.21,50.8 30.32,50.8 30.8,51.28 30.8,52.01 IC4.16
  Bottom 0.406: T3.E 2.54,57.47 2.54,49.53 T2.E 3.81,49.21 3.81,49.05 | 3.81,46.04 4.76,46.04 4.76,41.59 5.08,41.27 v6.35,41.27 | 8.89,21.27 8.89,20 8.57,19.69 ISP1.2 | 8.89,21.27 8.89,21.91 9.21,22.23 | 9.21,22.23 v12.7,22.23 12.7,21.27 8.89,21.27 | 29.05,50.48 29.05,47.31 19.68,38.1 19.05,38.1 19.05,37.46 18.73,37.15 18.1,37.15 | v59.69,14.92 59.69,16.83 61.28,18.41 61.28,39.05 59.21,39.05 | v56.52,49.21 R4.2 59.21,49.16 59.21,39.05 | v56.52,35.56 58.58,35.56 59.21,36.2 59.21,39.05 | 18.1,37.15 18.1,35.56 17.14,34.61 13.65,34.61 12.7,33.66 12.7,29.84 11.91,29.05 8.1,29.05 7.3,28.26 7.3,26.19 8.89,24.61 8.89,22.54 9.21,22.23 | IC4.10 33.97,59.69 v33.97,58.42 | IC4.16 33.97,52.07 v33.97,53.34 | 18.1,37.15 v18.1,38.1
  pour Top: 52.39,11.75 53.02,12.38 54.93,12.38 54.93,5.08 52.39,5.08
XTAL1
  Top 0.406: 4.6,36.2 Q1.2 5.59,34.64 5.87,34.92 5.87,35.72 5.56,36.04 4.76,36.04 4.6,36.2 | IC1.7 16.73,39.78 16.19,40.32 8.25,40.32 4.6,36.67 4.6,36.2 | C1.1 4.5,36.09 4.6,36.2
XTAL2
  Top 0.406: IC1.8 15.93,38.68 15.24,39.37 8.89,39.37 7.94,38.42 7.94,30.8 6.95,29.81 6.03,29.81 | 6.03,29.81 Q1.1 4.6,28.73 | 4.6,28.73 4.13,28.26 2.8,28.26 C2.1 | 4.6,28.73 6.03,28.73 6.03,29.81

### Text on the board
Top: CS | UP | DW | OK | EE-VECT | 1 | 1 | 1 | 36 | 4 | 2
Bottom: SS | 1 | VECTREX | SS | TR' 17 | 35 | 1